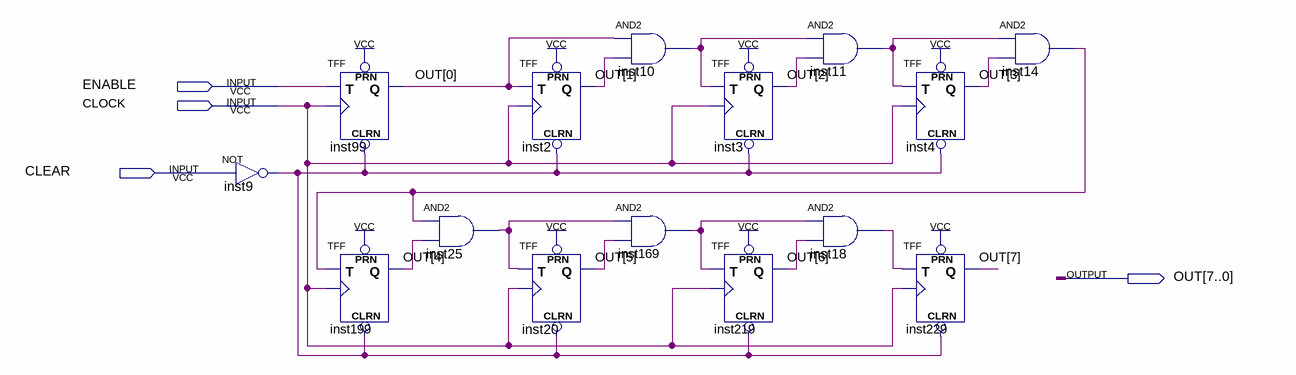
[diagram p0: schematic sheet]
// Quartus schematic CONTADOR.bdf as structural Verilog: 15 symbols, 4 pins
module CONTADOR (
  input  ENABLE,
  input  CLOCK,
  input  CLEAR,
  output [7:0] OUT
);

  wire inst9_out, inst10_out, inst11_out, inst14_out, inst18_out, inst25_out, inst169_out;

  not inst9 (inst9_out, CLEAR);
  TFF inst99 (.PRN(1'b1), .CLRN(inst9_out), .T(ENABLE), .CLK(CLOCK), .Q(OUT[0]));
  TFF inst199 (.PRN(1'b1), .CLRN(inst9_out), .T(inst14_out), .CLK(CLOCK), .Q(OUT[4]));
  and inst25 (inst25_out, inst14_out, OUT[4]);
  TFF inst2 (.PRN(1'b1), .CLRN(inst9_out), .T(OUT[0]), .CLK(CLOCK), .Q(OUT[1]));
  TFF inst20 (.PRN(1'b1), .CLRN(inst9_out), .T(inst25_out), .CLK(CLOCK), .Q(OUT[5]));
  and inst10 (inst10_out, OUT[0], OUT[1]);
  and inst169 (inst169_out, inst25_out, OUT[5]);
  TFF inst3 (.PRN(1'b1), .CLRN(inst9_out), .T(inst10_out), .CLK(CLOCK), .Q(OUT[2]));
  TFF inst219 (.PRN(1'b1), .CLRN(inst9_out), .T(inst169_out), .CLK(CLOCK), .Q(OUT[6]));
  and inst11 (inst11_out, inst10_out, OUT[2]);
  and inst18 (inst18_out, inst169_out, OUT[6]);
  TFF inst4 (.PRN(1'b1), .CLRN(inst9_out), .T(inst11_out), .CLK(CLOCK), .Q(OUT[3]));
  TFF inst229 (.PRN(1'b1), .CLRN(inst9_out), .T(inst18_out), .CLK(CLOCK), .Q(OUT[7]));
  and inst14 (inst14_out, inst11_out, OUT[3]);
endmodule
